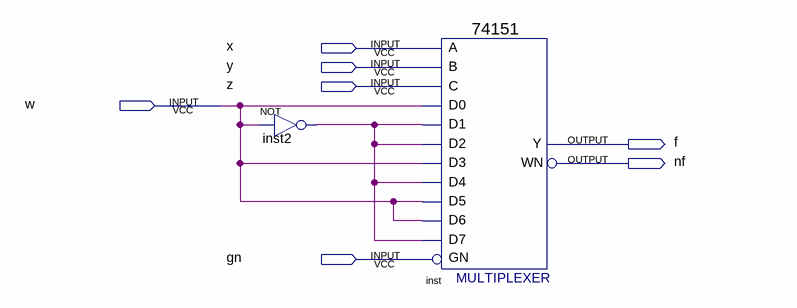
[diagram p0: schematic sheet]
// Quartus schematic lab7a.bdf as structural Verilog: 2 symbols, 7 pins
module lab7a (
  input  x,
  input  y,
  input  z,
  input  w,
  input  gn,
  output f,
  output nf
);

  wire inst2_out;

  not inst2 (inst2_out, w);
  \74151  inst (
    .GN(gn), .C(z), .B(y), .A(x), .D5(w), .D0(w), .D1(inst2_out), .D4(inst2_out), .D3(w), .D2(inst2_out),
    .D6(w), .D7(inst2_out), .Y(f), .WN(nf));
endmodule
